# Altium schematic sheet USB_OTG_FS.SchDoc: STM324x9I-EVAL USB_OTG_FS
size A4; DocumentNumber: 10; Revision: B.3; SheetNumber: 10; SheetTotal: 17
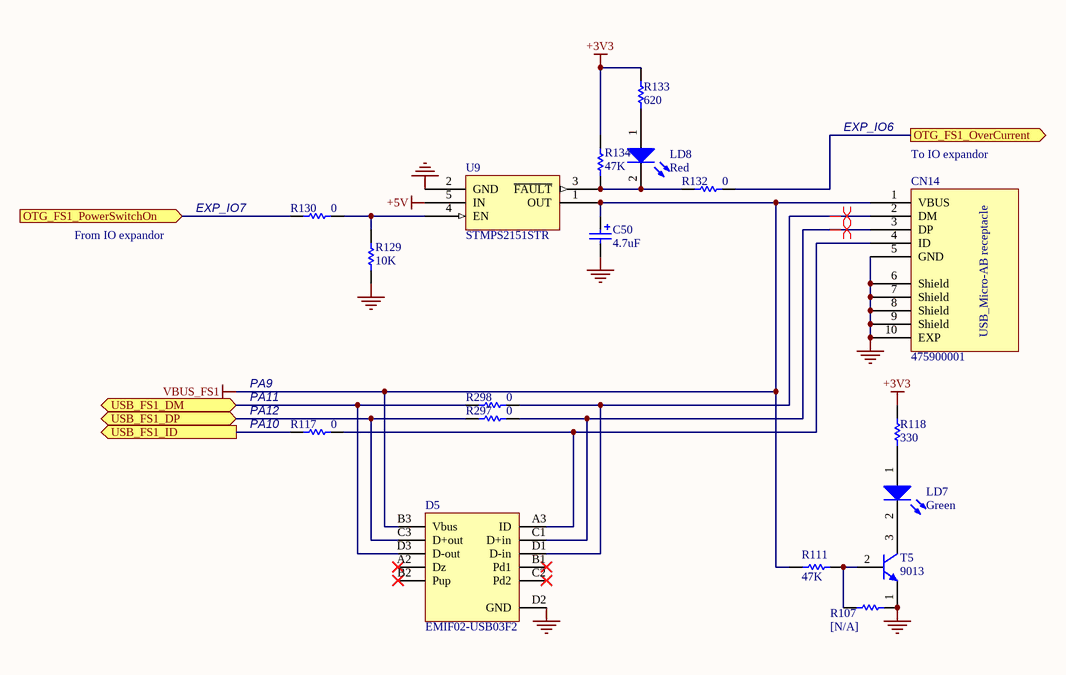
[diagram p0: USB_OTG_FS.SchDoc]

## Parts
C50  4.7uF  [TAN-A]
CN14  475900001  [MOLEX_47590001]
D5  EMIF02-USB03F2  [BGA11_0R5_1R57X2R07]
LD7  Green  [0603D]
LD8  Red  [0603D]
R107  [N/A]  [0603R]
R111  47K  [0603R]
R117  0  [0603R]
R118  330  [0603R]
R129  10K  [0603R]
R130  0  [0603R]
R132  0  [0603R]
R133  620  [0603R]
R134  47K  [0603R]
R297  0  [0603R]
R298  0  [0603R]
T5  9013  [SOT23-213]
U9  STMPS2151STR  [SOT23-5]

## Ports
OTG_FS1_OverCurrent (out), OTG_FS1_PowerSwitchOn (in), USB_FS1_DM (bidir), USB_FS1_DP (bidir), USB_FS1_ID (out)

## Nets
+3V3: R118.2 R133.2 R134.1
+5V: U9.5(IN)
GND: C50.2 CN14.5(GND) CN14.6(Shield) CN14.7(Shield) CN14.8(Shield) CN14.9(Shield) CN14.10(EXP) D5.D2(GND) R107.1 R129.1 T5.1(E) U9.2(GND)
VBUS_FS1: C50.1 CN14.1(VBUS) D5.B3(Vbus) R111.1 U9.1(OUT)
OTG_FS1_OverCurrent: R132.1 ; port OTG_FS1_OverCurrent
OTG_FS1_PowerSwitchOn: R130.2 ; port OTG_FS1_PowerSwitchOn
USB_FS1_DM: D5.D3(D-out) R298.2 ; port USB_FS1_DM
USB_FS1_DP: D5.C3(D+out) R297.2 ; port USB_FS1_DP
USB_FS1_ID: R117.2 ; port USB_FS1_ID
NetCN14_2: CN14.2(DM) D5.D1(D-in) R298.1
NetCN14_3: CN14.3(DP) D5.C1(D+in) R297.1
NetCN14_4: CN14.4(ID) D5.A3(ID) R117.1
NetLD7_1: LD7.1(A) R118.1
NetLD7_2: LD7.2(K) T5.3(C)
NetLD8_1: LD8.1(A) R133.1
NetLD8_2: LD8.2(K) R132.2 R134.2 U9.3(~{FAULT})
NetR107_2: R107.2 R111.2 T5.2(B)
NetR129_2: R129.2 R130.1 U9.4(EN)

Not connected (* = marked no-connect by the designer): D5 A2(Dz)* B1(Pd1)* B2(Pup)* C2(Pd2)*

## Layout directives
differential pair: NetCN14_2, NetCN14_3

## Notes on the sheet
- EXP_IO6
- EXP_IO7
- (near CN14) To IO expandor
- From IO expandor
- PA9
- (near R117) PA11
- (near R117) PA12
- (near R117) PA10
- Title:
- Project:
- Size:
- Revision:
- Variant:
- A4
- -
- Date:
- Reference:
- Sheet:
- of
- (in symbol 475900001) USB_Micro-AB receptacle

## Library data of the parts
C50 = Cap Pol1: Polarized Capacitor (Radial); Value: 47uF; Published: 8-Jun-2000; Revision: July-2002: Re-released for DXP Platform.; Publisher: Altium Limited
LD7 LD8 = LED2: Typical RED, GREEN, YELLOW, AMBER GaAs LED; Published: 8-Jun-2000; Revision: July-2002: Re-released for DXP Platform.; Publisher: Altium Limited
R107 R111 R118 R134 = res1: Resistor; Value: 1K; Published: 8-Jun-2000; Revision: July-2002: Re-released for DXP Platform.; Publisher: Altium Limited
R117 R129 R130 R132 R133 R297 R298 = Res1: Resistor; Value: 1K; Published: 8-Jun-2000; Revision: July-2002: Re-released for DXP Platform.; Publisher: Altium Limited
T5 = NPN: NPN Bipolar Transistor; Code - JEDEC: TO-226-AA; Published: 8-Jun-2000; Revision: July-2002: Re-released for DXP Platform.; Publisher: Altium Limited
U9 = STMPS2141STR